# Altium schematic sheet SWDPort.SchDoc
size A4; SheetNumber: 1; SheetTotal: 1
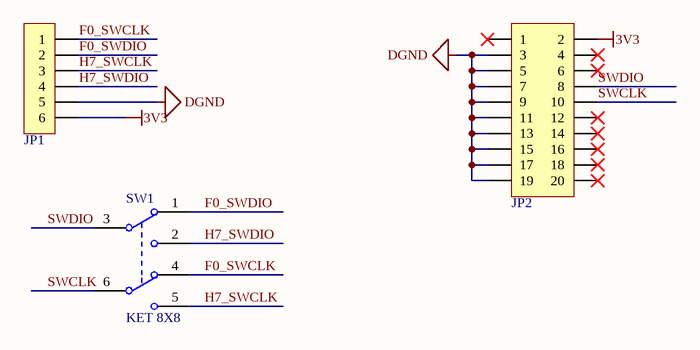
[diagram p0: SWDPort.SchDoc]

## Parts
JP1  HDR-1X6  [MX 1.25-WS-6P]  (value not drawn)
JP2  Header 2X10  [HDR2.54-LI-2x10P]  (value not drawn)
SW1  KET 8X8  [KFT DIP-8X8]

## Nets
3V3: JP1.6 JP2.2
DGND: JP1.5 JP2.3 JP2.5 JP2.7 JP2.9 JP2.11 JP2.13 JP2.15 JP2.17 JP2.19
F0_SWCLK: JP1.1 SW1.4(NO2)
F0_SWDIO: JP1.2 SW1.1(NC1)
H7_SWCLK: JP1.3 SW1.5(COM2)
H7_SWDIO: JP1.4 SW1.2(COM2)
SWCLK: JP2.10 SW1.6(NC2)
SWDIO: JP2.8 SW1.3(NO1)

Not connected (* = marked no-connect by the designer): JP2 1* 4* 6* 12* 14* 16* 18* 20*

## Library data of the parts
JP1 = Header 6: 6P接插件; 版权归属: 源创客; BOM名称: 6P接插件; 学习资源: www.ooocke.com
JP2 = Header 10X2: 10*2P接插件; 版权归属: 源创客; BOM名称: 10*2P接插件; 学习资源: www.ooocke.com
SW1 = KET 8X8: 8*8自锁开关; 版权归属: 源创客; BOM名称: 8*8自锁开关; 学习资源: www.ooocke.com